# EAGLE design 2_main (EAGLE 7.2.0)
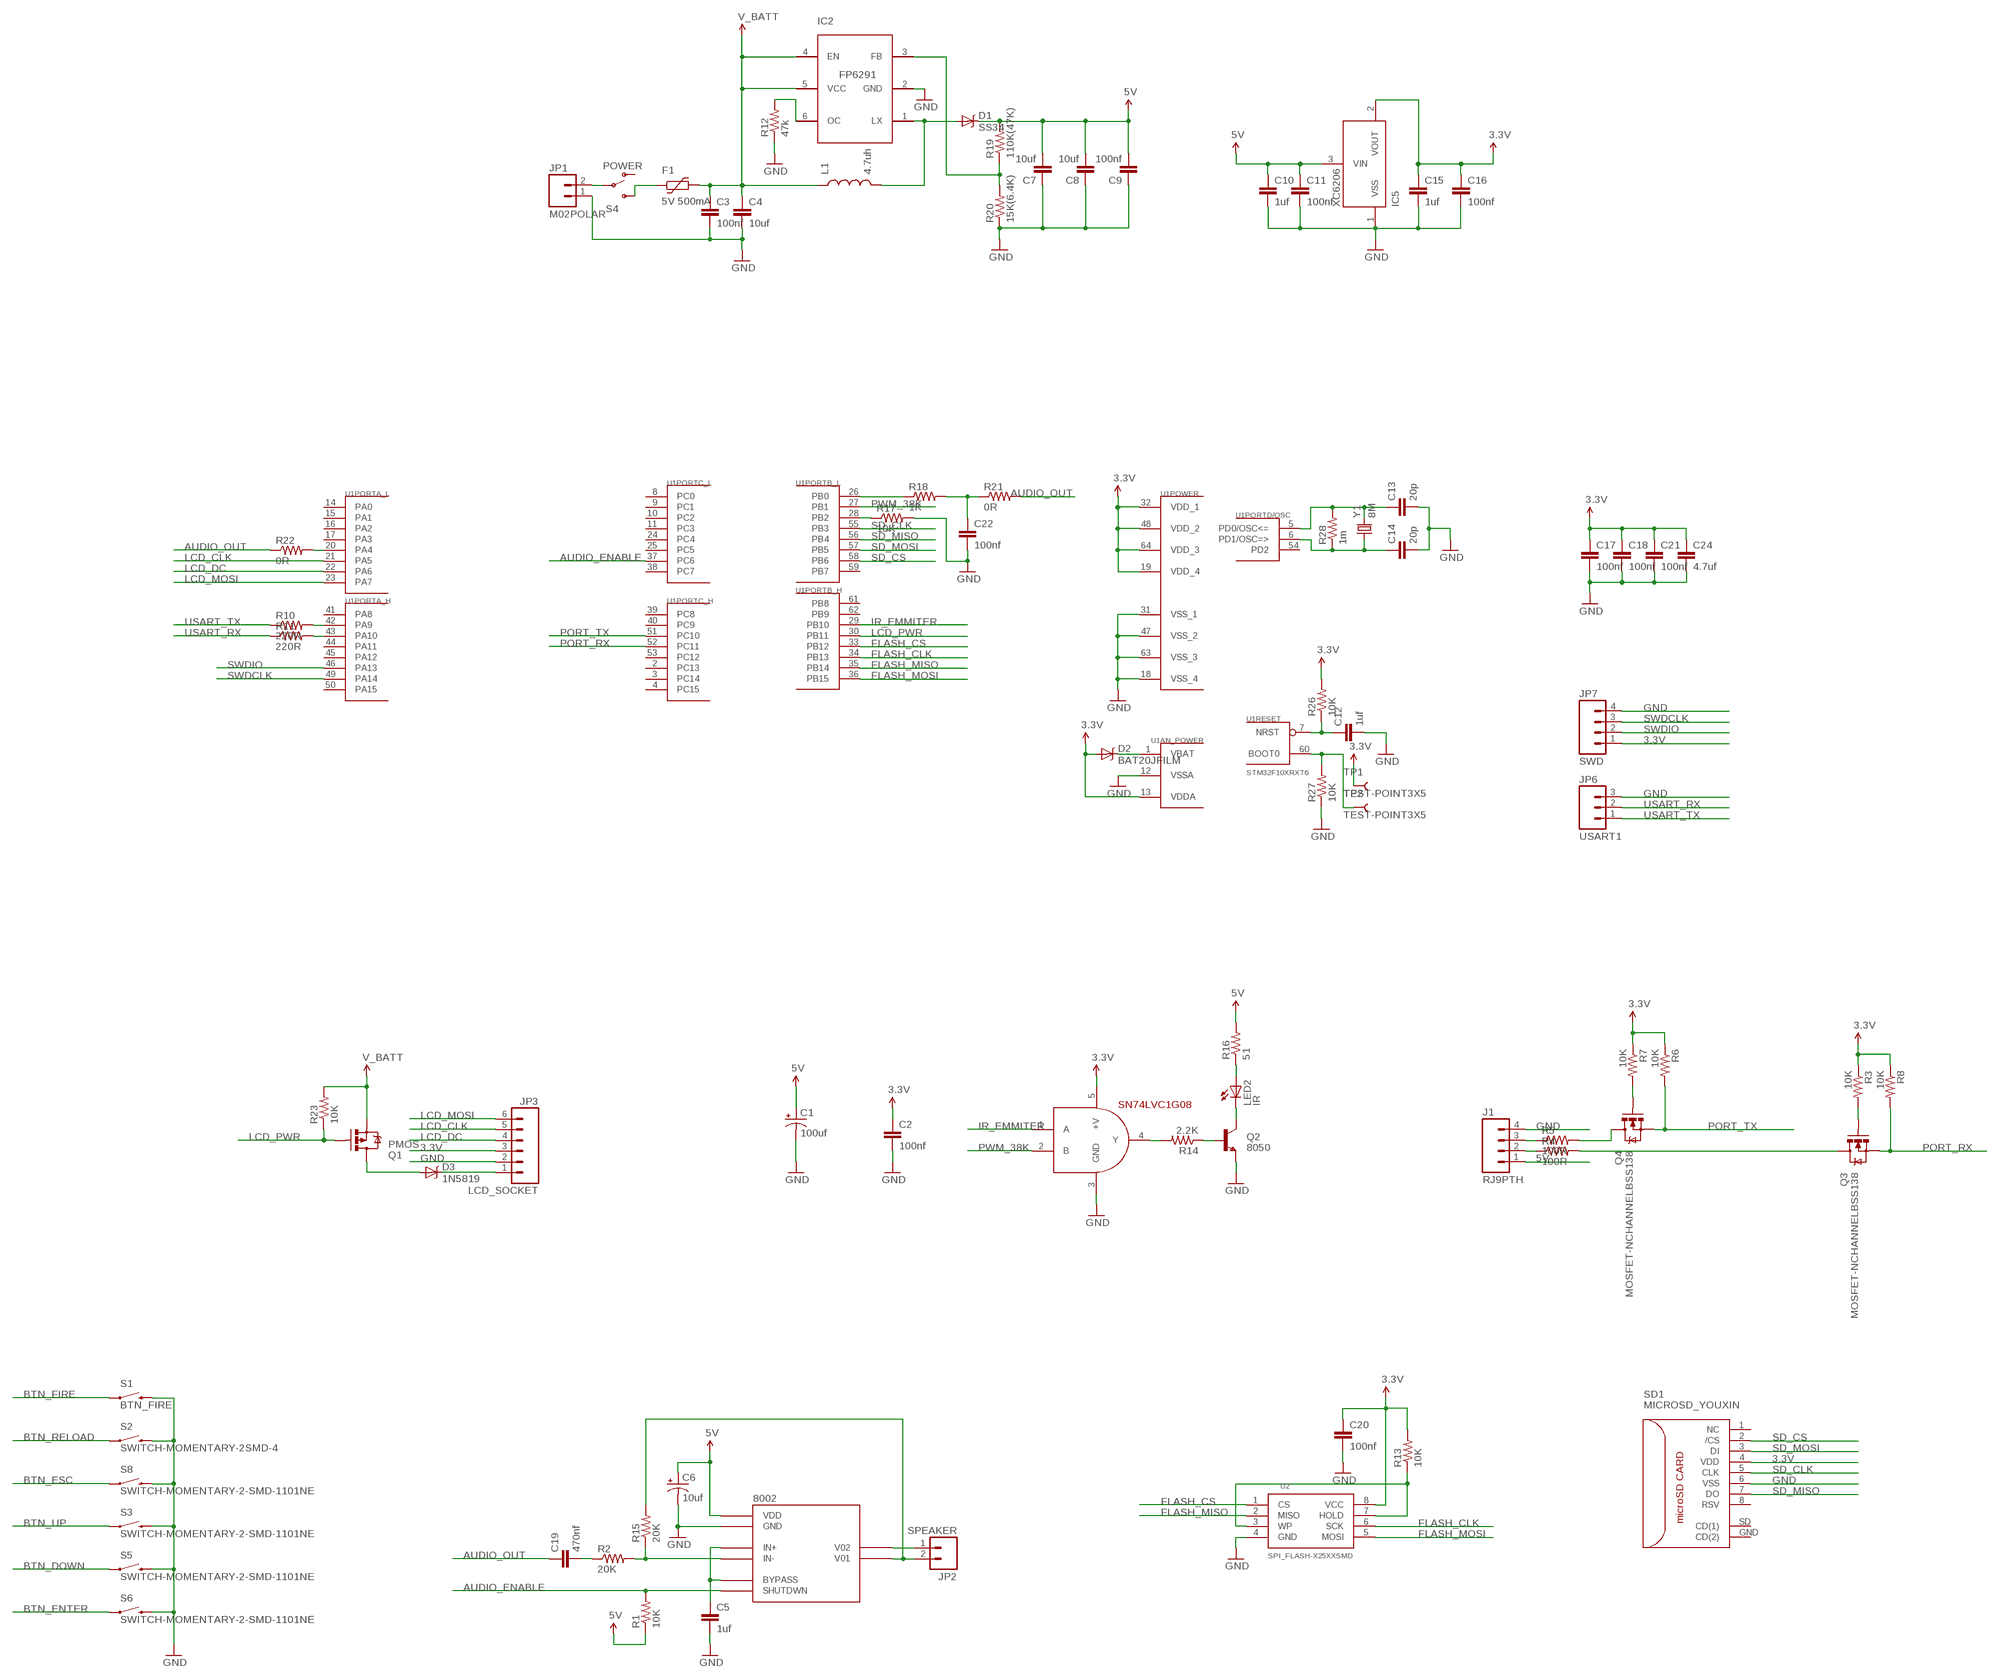
[diagram p0: schematic, sheet 1]

## Parts
8002  LM4871  [SO08]
C1  100uf  CAP_POL6032  [EIA6032]
C2  100nf  CAP0603-CAP  [0603-CAP]
C3  100nf  CAP0603-CAP  [0603-CAP]
C4  10uf  CAP0603-CAP  [0603-CAP]
C5  1uf  CAP0603-CAP  [0603-CAP]
C6  10uf  CAP_POL1206-KIT  [EIA3216-KIT]
C7  10uf  CAP0603-CAP  [0603-CAP]
C8  10uf  CAP0603-CAP  [0603-CAP]
C9  100nf  CAP0603-CAP  [0603-CAP]
C10  1uf  CAP0603-CAP  [0603-CAP]
C11  100nf  CAP0603-CAP  [0603-CAP]
C12  1uf  CAP0603-CAP  [0603-CAP]
C13  20p  CAP0603-CAP  [0603-CAP]
C14  20p  CAP0603-CAP  [0603-CAP]
C15  1uf  CAP0603-CAP  [0603-CAP]
C16  100nf  CAP0603-CAP  [0603-CAP]
C17  100nf  CAP0603-CAP  [0603-CAP]
C18  100nf  CAP0603-CAP  [0603-CAP]
C19  470nf  CAP0603-CAP  [0603-CAP]
C20  100nf  CAP0603-CAP  [0603-CAP]
C21  100nf  CAP0603-CAP  [0603-CAP]
C22  100nf  CAP0603-CAP  [0603-CAP]
C24  4.7uf  CAP0603-CAP  [0603-CAP]
D1  SS34  DIODE-SCHOTTKY_  [SMA-DIODE]
D2  BAT20JFILM  [SOD-323]
D3  1N5819  BAT20JFILM  [SOD-323]
F1  5V 500mA  PTC-FUSE  [R0805]
IC1  SN74LVC1G08  [SOT23-5]
IC2  FP6291  [SOT23-6]
IC5  XC6206  [SOT23-3]
J1  RJ9PTH  [RJ9]
JP1  M02POLAR  [MOLEX-1X2]
JP2  SPEAKER  M02POLAR  [MOLEX-1X2]
JP3  LCD_SOCKET  M06POLAR  [MOLEX-1X6]
JP6  USART1  M03PTH  [1X03]
JP7  SWD  M04PTH  [1X04]
L1  4.7uh  INDUCTORCR75_V2  [CR75_V2]
LED2  IR  LED5MM  [LED5MM]
Q1  PMOS  MOSFET-PCHANNELSMD  [SOT23-3]
Q2  8050  TRANSISTOR_NPNSOT23  [SOT23]
Q3  MOSFET-NCHANNELBSS138  [SOT23]
Q4  MOSFET-NCHANNELBSS138  [SOT23]
R1  10K  RESISTOR0603-RES  [0603-RES]
R2  20K  RESISTOR0603-RES  [0603-RES]
R3  10K  RESISTOR0603-RES  [0603-RES]
R4  100R  RESISTOR0603-RES  [0603-RES]
R5  100R  RESISTOR0603-RES  [0603-RES]
R6  10K  RESISTOR0603-RES  [0603-RES]
R7  10K  RESISTOR0603-RES  [0603-RES]
R8  10K  RESISTOR0603-RES  [0603-RES]
R10  220R  RESISTOR0603-RES  [0603-RES]
R11  220R  RESISTOR0603-RES  [0603-RES]
R12  47k  RESISTOR0603-RES  [0603-RES]
R13  10K  RESISTOR0603-RES  [0603-RES]
R14  2.2K  RESISTOR0603-RES  [0603-RES]
R15  20K  RESISTOR0603-RES  [0603-RES]
R16  51  RESISTOR0603-RES  [0603-RES]
R17  10K  RESISTOR0603-RES  [0603-RES]
R18  1K  RESISTOR0603-RES  [0603-RES]
R19  110K(47K)  RESISTOR0603-RES  [0603-RES]
R20  15K(6.4K)  RESISTOR0603-RES  [0603-RES]
R21  0R  RESISTOR0603-RES  [0603-RES]
R22  0R  RESISTOR0603-RES  [0603-RES]
R23  10K  RESISTOR0603-RES  [0603-RES]
R26  10K  RESISTOR0603-RES  [0603-RES]
R27  10K  RESISTOR0603-RES  [0603-RES]
R28  1m  RESISTOR0603-RES  [0603-RES]
S1  BTN_FIRE  SWITCH-MOMENTARY-2SMD-4  [TACTILE_SWITCH_TALL]
S2  SWITCH-MOMENTARY-2SMD-4  [TACTILE_SWITCH_TALL]
S3  SWITCH-MOMENTARY-2-SMD-1101NE  [TACTILE-SWITCH-1101NE]
S4  POWER  SWITCH-SPST3AM6  [SWITCH-SPDT-AM#6]
S5  SWITCH-MOMENTARY-2-SMD-1101NE  [TACTILE-SWITCH-1101NE]
S6  SWITCH-MOMENTARY-2-SMD-1101NE  [TACTILE-SWITCH-1101NE]
S8  SWITCH-MOMENTARY-2-SMD-1101NE  [TACTILE-SWITCH-1101NE]
SD1  MICROSD_YOUXIN  [MICRO_SD_YOUXIN]
TP1  TEST-POINT3X5  [PAD.03X.05]
TP2  TEST-POINT3X5  [PAD.03X.05]
U1  STM32F10XRXT6  [TQFP64]
U2  SPI_FLASH-X25XXSMD  [SO08]
Y1  8M  CRYSTALTXC-7A  [CRYSTAL-TXC-7A]

## Nets
3.3V: C2.1 C15.1 C16.1 C17.1 C18.1 C20.1 C21.1 C24.1 D2.2(A) IC1.5(+V) IC5.2(VOUT) JP3.3 JP7.1 R3.1 R6.1 R7.1 R8.1 R13.2 R26.2 SD1.4(VDD) TP1.P$1 U1.13(AN_POWER:VDDA) U1.19(POWER:VDD_4) U1.32(POWER:VDD_1) U1.48(POWER:VDD_2) U1.64(POWER:VDD_3) U2.8(VCC)
5V: 8002.6(VDD) C1.P$1(+) C6.A(+) C7.2 C8.2 C9.2 C10.1 C11.1 D1.C IC5.3(VIN) J1.1 R1.1 R16.2 R19.2
AUDIO_ENABLE: 8002.1(SHUTDWN) R1.2 U1.37(PORTC_L:PC6)
AUDIO_OUT: C19.1 R21.2 R22.1
BTN_DOWN: S5.P$1
BTN_ENTER: S6.P$1
BTN_ESC: S8.P$1
BTN_FIRE: S1.A2
BTN_RELOAD: S2.A2
BTN_UP: S3.P$1
FLASH_CLK: U1.34(PORTB_H:PB13) U2.6(SCK)
FLASH_CS: U1.33(PORTB_H:PB12) U2.1(CS)
FLASH_MISO: U1.35(PORTB_H:PB14) U2.2(MISO)
FLASH_MOSI: U1.36(PORTB_H:PB15) U2.5(MOSI)
GND: 8002.7(GND) C1.P$2(-) C2.2 C3.2 C4.2 C5.2 C6.C(-) C7.1 C8.1 C9.1 C10.2 C11.2 C12.2 C13.2 C14.2 C15.2 C16.2 C17.2 C18.2 C20.2 C21.2 C22.2 C24.2 IC1.3(GND) IC2.2(GND) IC5.1(VSS) J1.4 JP1.1 JP3.2 JP6.3 JP7.4 Q2.2(E) R12.1 R17.2 R20.1 R27.1 S1.B2 S2.B2 S3.P$2 S5.P$2 S6.P$2 S8.P$2 SD1.6(VSS) U1.12(AN_POWER:VSSA) U1.18(POWER:VSS_4) U1.31(POWER:VSS_1) U1.47(POWER:VSS_2) U1.63(POWER:VSS_3) U2.4(GND)
IR_EMMITER: IC1.1(A) U1.29(PORTB_H:PB10)
LCD_CLK: JP3.5 U1.21(PORTA_L:PA5)
LCD_DC: JP3.4 U1.22(PORTA_L:PA6)
LCD_MOSI: JP3.6 U1.23(PORTA_L:PA7)
LCD_PWR: Q1.1(G) R23.1 U1.30(PORTB_H:PB11)
N$1: R17.1 U1.28(PORTB_L:PB2)
N$2: R27.2 TP2.P$1 U1.60(RESET:BOOT0)
N$3: C13.1 R28.2 U1.5(PORTD/OSC:PD0/OSC<=) Y1.P$2
N$4: C14.1 R28.1 U1.6(PORTD/OSC:PD1/OSC=>) Y1.P$1
N$5: D2.1(C) U1.1(AN_POWER:VBAT)
N$6: IC1.4(Y) R14.2
N$7: JP1.2 S4.2(P)
N$8: LED2.K(C) Q2.3(C)
N$9: Q2.1(B) R14.1
N$10: F1.1 S4.3(S)
N$11: Q3.3(D) R4.2
N$12: J1.3 R5.1
N$13: Q4.3(D) R5.2
N$14: R18.1 U1.26(PORTB_L:PB0)
N$15: 8002.8(V02) JP2.1
N$16: Q4.1(G) R7.2
N$17: Q3.1(G) R3.2
N$18: 8002.5(V01) JP2.2 R15.2
N$19: C19.2 R2.1
N$20: LED2.A R16.1
N$21: 8002.4(IN-) R2.2 R15.1
N$22: D1.A IC2.1(LX) L1.P$2
N$23: IC2.6(OC) R12.2
N$24: 8002.2(BYPASS) 8002.3(IN+) C5.1
N$25: IC2.3(FB) R19.1 R20.2
N$26: R13.1 U2.3(WP) U2.7(HOLD)
N$27: R10.2 U1.42(PORTA_H:PA9)
N$28: R11.2 U1.43(PORTA_H:PA10)
N$29: D3.1(C) JP3.1
N$30: C22.1 R18.2 R21.1
N$31: R22.2 U1.20(PORTA_L:PA4)
N$32: D3.2(A) Q1.3(D)
N$40: J1.2 R4.1
N$44: C12.1 R26.1 U1.7(RESET:NRST)
PORT_RX: Q3.2(S) R8.2 U1.52(PORTC_H:PC11)
PORT_TX: Q4.2(S) R6.2 U1.51(PORTC_H:PC10)
PWM_38K: IC1.2(B) U1.27(PORTB_L:PB1)
SD_CLK: SD1.5(CLK) U1.55(PORTB_L:PB3)
SD_CS: SD1.2(/CS) U1.58(PORTB_L:PB6)
SD_MISO: SD1.7(DO) U1.56(PORTB_L:PB4)
SD_MOSI: SD1.3(DI) U1.57(PORTB_L:PB5)
SWDCLK: JP7.3 U1.49(PORTA_H:PA14)
SWDIO: JP7.2 U1.46(PORTA_H:PA13)
USART_RX: JP6.2 R11.1
USART_TX: JP6.1 R10.1
V_BATT: C3.1 C4.1 F1.2 IC2.4(EN) IC2.5(VCC) L1.P$1 Q1.2(S) R23.2
Unconnected: S4.1(O) SD1.1(NC) SD1.8(RSV) SD1.GND(CD(2)) SD1.SD(CD(1)) U1.2(PORTC_H:PC13) U1.3(PORTC_H:PC14) U1.4(PORTC_H:PC15) U1.8(PORTC_L:PC0) U1.9(PORTC_L:PC1) U1.10(PORTC_L:PC2) U1.11(PORTC_L:PC3) U1.14(PORTA_L:PA0) U1.15(PORTA_L:PA1) U1.16(PORTA_L:PA2) U1.17(PORTA_L:PA3) U1.24(PORTC_L:PC4) U1.25(PORTC_L:PC5) U1.38(PORTC_L:PC7) U1.39(PORTC_H:PC8) U1.40(PORTC_H:PC9) U1.41(PORTA_H:PA8) U1.44(PORTA_H:PA11) U1.45(PORTA_H:PA12) U1.50(PORTA_H:PA15) U1.53(PORTC_H:PC12) U1.54(PORTD/OSC:PD2) U1.59(PORTB_L:PB7) U1.61(PORTB_H:PB8) U1.62(PORTB_H:PB9)

## Library data of the parts
8002 = SparkFun-PowerIC:LM4871: 3W audio amplifier
C1 C6 = SparkFun-Capacitors:CAP_POL: Capacitor Polarized These are standard SMD and PTH capacitors. Normally 10uF, 47uF, and 100uF in electrolytic and tantalum varieties. Always verify the external diameter of the through hole cap, it varies with capacity, voltage, and manufacturer. The EIA devices should be standard.
C2-C5 C7-C22 C24 = SparkFun-Passives:CAP: Capacitor Standard 0603 ceramic capacitor, and 0.1" leaded capacitor.
D1 = SparkFun-DiscreteSemi:DIODE-SCHOTTKY: Commonly MBRA140.
D2 = SparkFun-DiscreteSemi:BAT20JFILM: 23V, 1A Schottky diode, SOD-323 package; PROD_ID: DIO-11623
D3 = SparkFun-DiscreteSemi:BAT20JFILM: 23V, 1A Schottky diode, SOD-323 package; PROD_ID: DIO-11623; VALUE: BAT20JFILM
F1 = digital-toy:PTC-FUSE
IC1 = SparkFun-DigitalIC:SN74LVC1G08: Single-gate AND logic
IC2 = eagle_lib_lishen:FP6291
IC5 = SparkFun-PowerIC:XC6206: Low ESR Cap. Compatible Positive Voltage Regulator
J1 = SparkFun-Connectors:RJ9: RJ9 connector (e.g., phone handsets)
JP1 JP2 = SparkFun-Connectors:M02: Standard 2-pin 0.1" header. Use with - straight break away headers ( PRT-00116) - right angle break away headers (PRT-00553) - swiss pins (PRT-00743) - machine pins (PRT-00117) - female headers (PRT-00115) Molex polarized connector foot print use with: PRT-08233 with associated crimp pins and housings. 2.54_SCREWTERM for use with PRT-10571. 3.5mm Screw Terminal footprints for PRT-08084 5mm Screw Terminal footprints for use with PRT-08433
JP3 = SparkFun-Connectors:M06: Header 6 Standard 6-pin 0.1" header. Use with straight break away headers (SKU : PRT-00116), right angle break away headers (PRT-00553), swiss pins (PRT-00743), machine pins (PRT-00117), and female headers (PRT-00115). Molex polarized connector foot print use with SKU : PRT-08094 with associated crimp pins and housings. NOTES ON THE VARIANTS LOCK and LOCK_LONGPADS... This footprint was designed to help hold the alignment of a through-hole component (i.e. 6-pin header) while soldering it into place. You may notice that each hole has been shifted either up or down by 0.005 of an inch from it's more standard position (which is a perfectly straight line). This slight alteration caused the pins (the squares in the middle) to touch the edges of the holes. Because they are alternating, it causes a "brace" to hold the component in place. 0.005 has proven to be the perfect amount of "off-center" position when using our standard breakaway headers. Although looks a little odd when you look at the bare footprint, once you have a header in there, the alteration is very hard to notice. Also,if you push a header all the way into place, it is covered up entirely on the bottom side. This idea of altering the position of holes to aid alignment will be further integrated into the Sparkfun Library for other footprints. It can help hold any component with 3 or more connection pins.
JP6 = SparkFun-Connectors:M03: Header 3 Standard 3-pin 0.1" header. Use with straight break away headers (SKU : PRT-00116), right angle break away headers (PRT-00553), swiss pins (PRT-00743), machine pins (PRT-00117), and female headers (PRT-00115). Molex polarized connector foot print use with SKU : PRT-08232 with associated crimp pins and housings.
JP7 = SparkFun-Connectors:M04: Header 4 Standard 4-pin 0.1" header. Use with straight break away headers (SKU : PRT-00116), right angle break away headers (PRT-00553), swiss pins (PRT-00743), machine pins (PRT-00117), and female headers (PRT-00115). Molex polarized connector foot print use with SKU : PRT-08231 with associated crimp pins and housings. 1MM SMD Version SKU: PRT-10208
L1 = SparkFun-Passives:INDUCTOR: Inductors Basic Inductor/Choke - 0603 and 1206. Footprints are not proven and vary greatly between part numbers. SRN6045- 33uH, 20% 1.4A SDR0403-560KL - 56uH, 10%, 500mA RMS/740mA peak
LED2 = SparkFun-LED:LED: LEDs Standard schematic elements and footprints for 5mm, 3mm, 1206, and 0603 sized LEDs. 5mm - Spark Fun Electronics SKU : COM-00529 (and others)
Q1 = SparkFun-DiscreteSemi:MOSFET-PCHANNEL: Generic PMOSFET
Q2 = SparkFun-DiscreteSemi:TRANSISTOR_NPN: Generic NPN BJT MMBT2222A - TRANS-08049 (SOT-23, 1A 40V) MPSA42 - TRANS-09116 (SOT-23, 500mA 300V) MMBT5088LT1G - TRANS-11160 (SOT-23, 50 mA 30V)
Q3 Q4 = SparkFun-DiscreteSemi:MOSFET-NCHANNEL: Common NMOSFET Parts MFG P/N Store ID Prod ID FDD8780 TRANS-09984 SI7820DN TRANS-11055 FDS6630A IC-08089 2N7002PW TRANS-11151 FQP30N06L COM-10213 TRANS-10060 BSS123LT1G TRANS-08345 BSS138 TRANS-00830 BS170 2N7000; PROD_ID: TRANS-00830
R1-R8 R10-R23 R26-R28 = SparkFun-Passives:RESISTOR: Resistor Basic schematic elements and footprints for 0603, 1206, and PTH resistors.
S1-S3 S5 S6 S8 = SparkFun-Electromechanical:SWITCH-MOMENTARY-2: Various NO switches- pushbuttons, reed, etc
S4 = digital-toy:SWITCH-SPST: SPST Switch Simple slide switch. Spark Fun Electronics SKU : COM-00102
SD1 = eagle_lib_lishen:MICROSD_YOUXIN
TP1 TP2 = SparkFun-Passives:TEST-POINT: Bare copper test points for troubleshooting or ICT
U1 = stm32:STM32F10XRXT6: STM32F101/103 64pin LQFP
U2 = SparkFun-DigitalIC:SPI_FLASH-X25XX: 8pin SPI Flash series x25xx. Works with devices like W25X32 and BR25L32
Y1 = SparkFun-FreqCtrl:CRYSTAL: Various standard crystals. Proven footprints. Spark Fun Electronics SKU : COM-00534

## Board
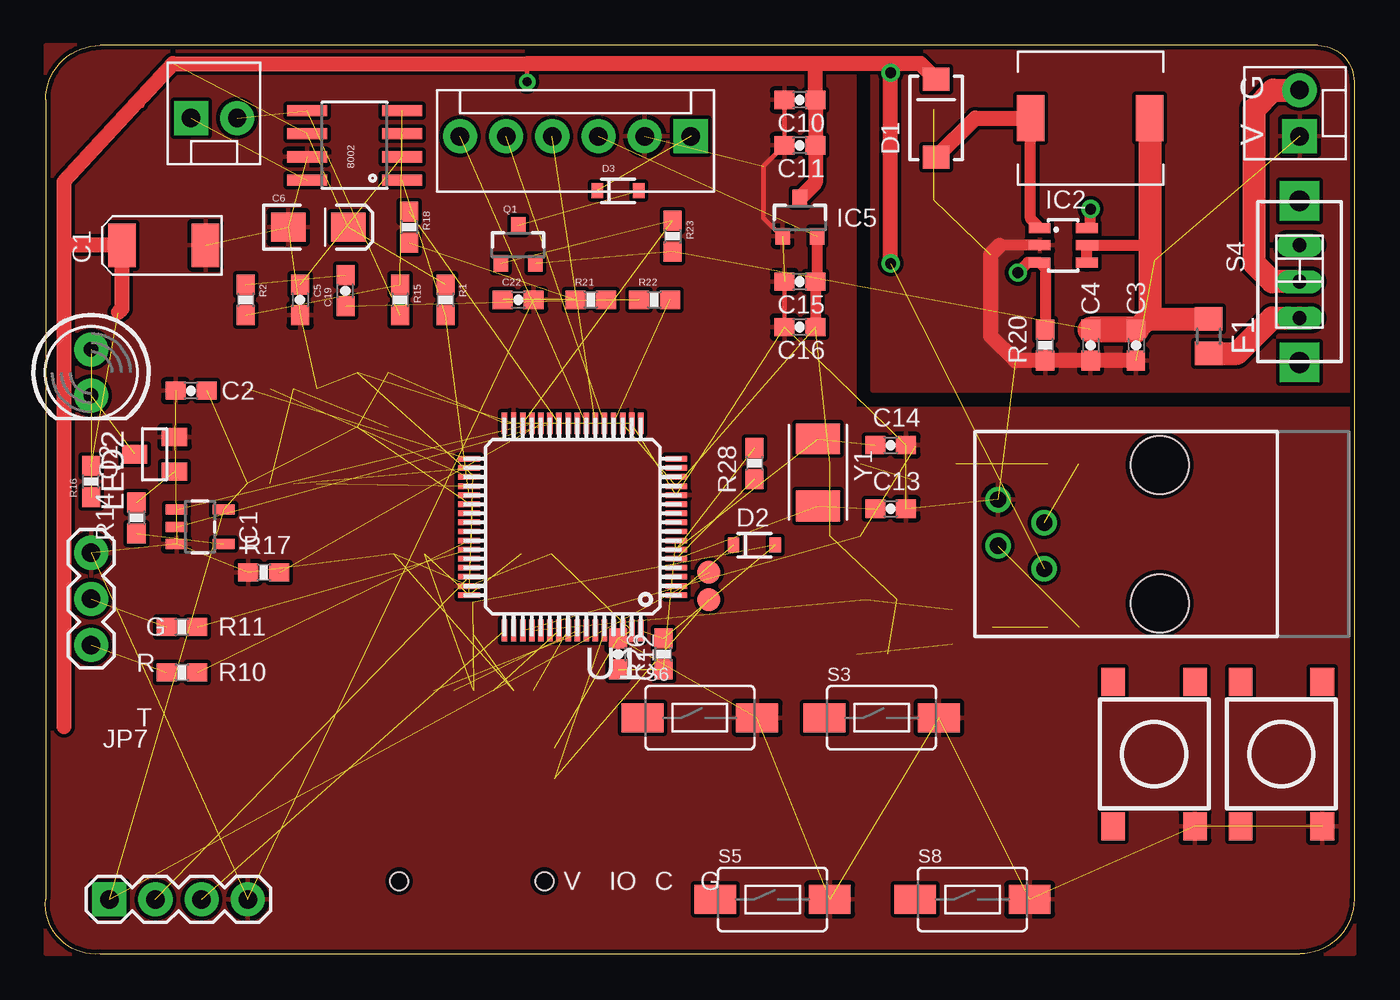
[diagram p1: board, top side]
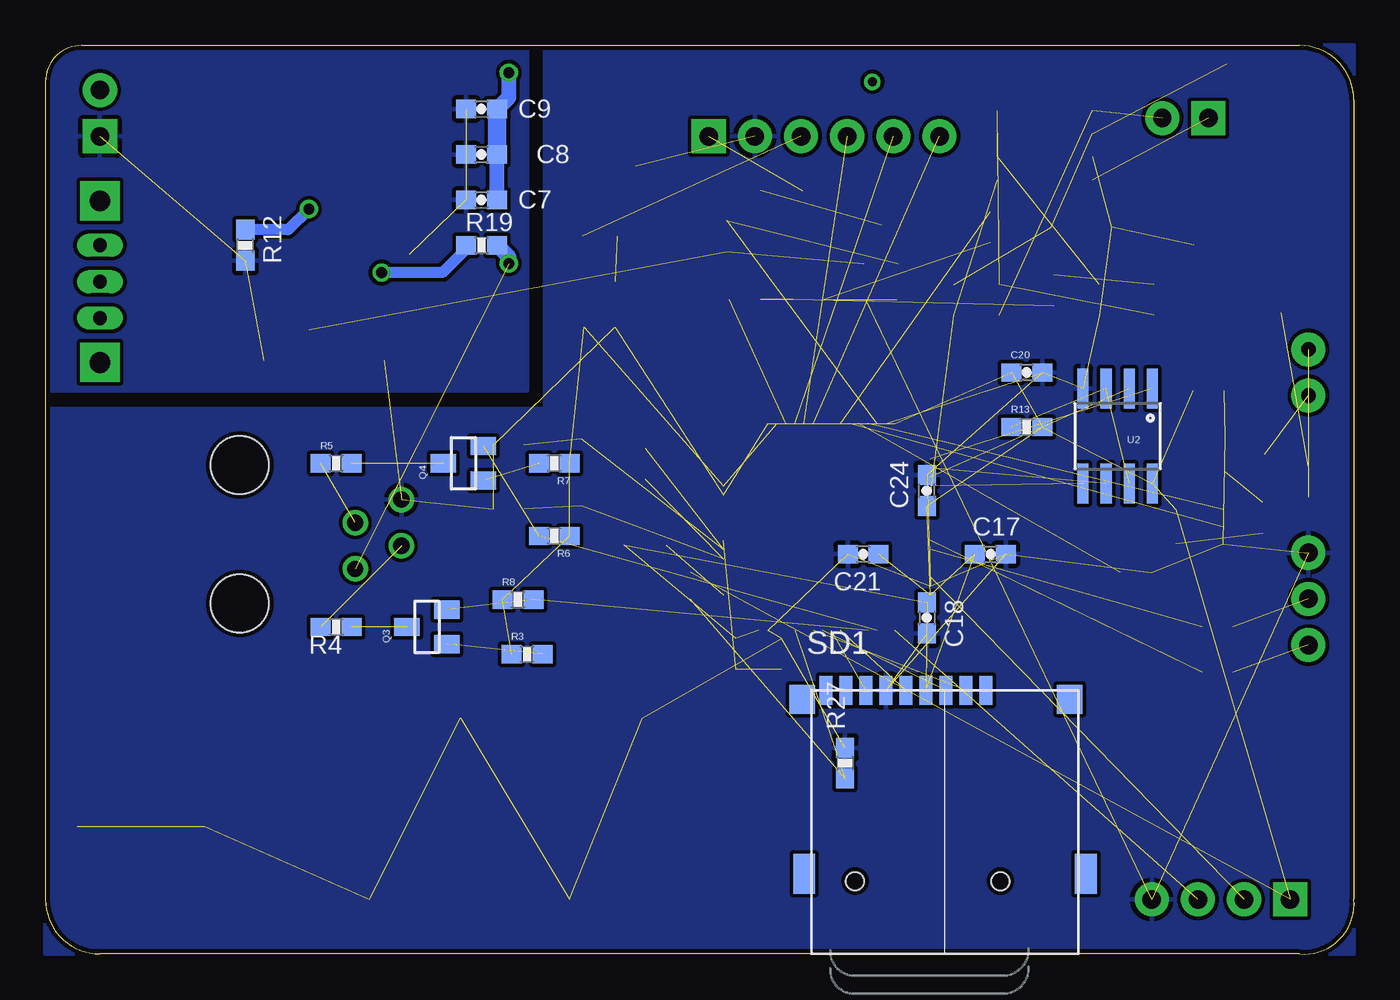
[diagram p2: board, bottom side, seen from below]

Size 72.01 x 50.01 mm. Coordinates in mm from the lower left corner, seen from the top.
Outline: 70.01,50.01 3.01,50.01 arc90 0.01,47.01 0.01,3.01 arc100 3.01,0.01 69.01,0.01 arc90 72.01,3.01 72.01,48.01 arc90 70.01,50.01
Copper layers (1*16): Top 0.035mm / dielectric 1.5mm / Bottom 0.035mm
Design rules "default *": minimum track width 10mil, minimum drill 0.5mm, track to track 8mil, track to pad 8mil, pad to pad 8mil, via to via 8mil, smd to smd 8mil, copper to edge 10mil, drill to drill 8mil, minimum pad ring 10mil, minimum via ring 8mil, stop-mask expansion 4mil, vias tented up to drill 0mil, thermal gap 10mil

### Footprints (pad centres in the part's own frame; a part is rotated, then mirrored left to right if it is on the bottom)
SO08 = smd 0.61 x 2.21: 1 -1.905,-2.616; 2 -0.635,-2.616; 3 0.635,-2.616; 4 1.905,-2.616; 5 1.905,2.616; 6 0.635,2.616; 7 -0.635,2.616; 8 -1.905,2.616
EIA6032 = smd 1.5 x 2.4: P$1 -2.3,0; P$2 2.3,0
0603-CAP = smd 1.1 x 1: 1 -0.85,0; 2 0.85,0
EIA3216-KIT = smd 1.9 x 1.6: A 1.65,0; C -1.65,0
SMA-DIODE = smd 1.27 x 1.47: A -2.15,0; C 2.15,0
SOD-323 = smd 0.63 x 0.83: 1 -1.15,0; 2 1.15,0
R0805 = smd 1.3 x 1.5: 1 -0.95,0; 2 0.95,0
SOT23-5 = smd 0.55 x 1.2: 1 -0.95,-1.3; 2 0,-1.3; 3 0.95,-1.3; 4 0.95,1.3; 5 -0.95,1.3
SOT23-6 = smd 0.55 x 1.2: 1 -0.95,-1.3; 2 0,-1.3; 3 0.95,-1.3; 4 0.95,1.3; 5 0,1.3; 6 -0.95,1.3
SOT23-3 = smd 0.8 x 0.9: 1 -0.95,-1; 2 0.95,-1; 3 0,1.1
RJ9 = drill 0.889: 1 -1.905,6.35; 2 -0.635,8.89; 3 0.635,6.35; 4 1.905,8.89 | hole 3.2: -3.81,0; 3.81,0
MOLEX-1X2 = drill 1.016 pad 1.88 square: 1 0,0 | drill 1.016 pad 1.88: 2 2.54,0
MOLEX-1X6 = drill 1.016 pad 1.88 square: 1 0,0 | drill 1.016 pad 1.88: 2 2.54,0; 3 5.08,0; 4 7.62,0; 5 10.16,0; 6 12.7,0
1X03 = drill 1.016 pad 1.88: 1 0,0; 2 2.54,0; 3 5.08,0
1X04 = drill 1.016 pad 1.88 square: 1 0,0 | drill 1.016 pad 1.88: 2 2.54,0; 3 5.08,0; 4 7.62,0
CR75_V2 = smd 1.524 x 2.54: P$1 -0.254,0; P$2 6.304,0
LED5MM = drill 0.813 pad 1.88: A -1.27,0; K 1.27,0
SOT23 = smd 1 x 1.4: 1 -0.95,-1.1; 2 0.95,-1.1; 3 0,1.1
0603-RES = smd 1.1 x 1: 1 -0.85,0; 2 0.85,0
TACTILE_SWITCH_TALL = smd 1.55 x 1.3: A1 -3.975,-2.25; A2 3.975,-2.25; B1 -3.975,2.25; B2 3.975,2.25
TACTILE-SWITCH-1101NE = smd 2.3 x 1.6: P$1 -3.15,0; P$2 3.15,0
SWITCH-SPDT-AM#6 = drill 0.762 pad 1.27 long: 1 0,2; 2 0,0; 3 0,-2 | drill 1.15 pad 2.184 square: P$1 0,-4.445; P$2 0,4.445
MICRO_SD_YOUXIN = smd 0.7 x 1.6: 1 2.25,14.5; 2 1.15,14.5; 3 0.05,14.5; 4 -1.05,14.5; 5 -2.15,14.5; 6 -3.25,14.5; 7 -4.35,14.5; 8 -5.45,14.5; SD -6.55,14.5 | smd 1.4 x 1.6: GND -7.85,14; P$4 6.85,14 | smd 1.2 x 2.2: P$1 -7.75,4.4; P$3 7.75,4.4 | hole 1: 3.05,4; -4.95,4
PAD.03X.05 = smd 1.27 x 1.27: P$1 0,0
TQFP64 = smd 1.2 x 0.3: 1 -5.7,3.75; 2 -5.7,3.25; 3 -5.7,2.75; 4 -5.7,2.25; 5 -5.7,1.75; 6 -5.7,1.25; 7 -5.7,0.75; 8 -5.7,0.25; 9 -5.7,-0.25; 10 -5.7,-0.75; 11 -5.7,-1.25; 12 -5.7,-1.75; 13 -5.7,-2.25; 14 -5.7,-2.75; 15 -5.7,-3.25; 16 -5.7,-3.75; 33 5.7,-3.75; 34 5.7,-3.25; 35 5.7,-2.75; 36 5.7,-2.25; 37 5.7,-1.75; 38 5.7,-1.25; 39 5.7,-0.75; 40 5.7,-0.25; 41 5.7,0.25; 42 5.7,0.75; 43 5.7,1.25; 44 5.7,1.75; 45 5.7,2.25; 46 5.7,2.75; 47 5.7,3.25; 48 5.7,3.75 | smd 0.3 x 1.2: 17 -3.75,-5.7; 18 -3.25,-5.7; 19 -2.75,-5.7; 20 -2.25,-5.7; 21 -1.75,-5.7; 22 -1.25,-5.7; 23 -0.75,-5.7; 24 -0.25,-5.7; 25 0.25,-5.7; 26 0.75,-5.7; 27 1.25,-5.7; 28 1.75,-5.7; 29 2.25,-5.7; 30 2.75,-5.7; 31 3.25,-5.7; 32 3.75,-5.7; 49 3.75,5.7; 50 3.25,5.7; 51 2.75,5.7; 52 2.25,5.7; 53 1.75,5.7; 54 1.25,5.7; 55 0.75,5.7; 56 0.25,5.7; 57 -0.25,5.7; 58 -0.75,5.7; 59 -1.25,5.7; 60 -1.75,5.7; 61 -2.25,5.7; 62 -2.75,5.7; 63 -3.25,5.7; 64 -3.75,5.7
CRYSTAL-TXC-7A = smd 1.7 x 2.4: P$1 1.85,0; P$2 -1.85,0

### Placement (x,y rotation side)
8002  17.01,44.51 90 top
C1  6.51,39.01 0 top
C2  8.01,31.01 180 top
C3  60.01,33.51 270 top
C4  57.51,33.51 270 top
C5  14.01,36.01 270 top
C6  15.01,40.01 0 top
C7  48.01,41.51 0 bottom
C8  48.01,44.01 0 bottom
C9  48.01,46.51 0 bottom
C10  41.51,47.01 180 top
C11  41.51,44.51 180 top
C12  31.51,16.51 90 top
C13  46.51,24.51 0 top
C14  46.51,28.01 0 top
C15  41.51,37.01 180 top
C16  41.51,34.51 180 top
C17  20.01,22.01 0 bottom
C18  23.51,18.51 270 bottom
C19  16.51,36.51 90 top
C20  18.01,32.01 0 bottom
C21  27.01,22.01 180 bottom
C22  26.01,36.01 0 top
C24  23.51,25.51 90 bottom
D1  49.01,46.01 90 top
D2  39.01,22.51 0 top
D3  31.51,42.01 0 top
F1  64.01,34.01 90 top
IC1  8.51,23.51 270 top
IC2  56.01,39.01 270 top
IC5  41.51,40.51 0 top
J1  61.31,23.11 90 top
JP1  69.01,45.01 90 top
JP2  8.01,46.01 0 top
JP3  35.51,45.01 180 top
JP6  2.51,17.01 90 top
JP7  3.51,3.01 0 top
L1  60.51,46.01 180 top
LED2  2.51,32.01 270 top
Q1  26.01,39.01 0 top
Q2  6.01,27.51 90 top
Q3  51.01,18.01 90 bottom
Q4  49.01,27.01 90 bottom
R1  22.01,36.01 270 top
R2  11.01,36.01 270 top
R3  45.51,16.51 0 bottom
R4  56.01,18.01 0 bottom
R5  56.01,27.01 0 bottom
R6  44.01,23.01 180 bottom
R7  44.01,27.01 180 bottom
R8  46.01,19.51 0 bottom
R10  7.51,15.51 0 top
R11  7.51,18.01 0 top
R12  61.01,39.01 90 bottom
R13  18.01,29.01 0 bottom
R14  5.01,24.01 270 top
R15  19.51,36.01 270 top
R16  2.51,26.01 90 top
R17  12.01,21.01 180 top
R18  20.01,40.01 270 top
R19  48.01,39.01 0 bottom
R20  55.01,33.51 90 top
R21  30.01,36.01 0 top
R22  33.51,36.01 0 top
R23  34.51,39.51 270 top
R26  34.01,16.51 90 top
R27  28.01,10.51 270 bottom
R28  39.01,27.01 270 top
S1  61.01,11.01 270 top
S2  68.01,11.01 270 top
S3  46.01,13.01 0 top
S4  69.01,37.01 0 top
S5  40.01,3.01 0 top
S6  36.01,13.01 0 top
S8  51.01,3.01 0 top
SD1  22.51,0.01 0 bottom
TP1  36.51,21.01 0 top
TP2  36.51,19.51 0 top
U1  29.01,23.51 180 top
U2  13.01,28.51 180 bottom
Y1  42.51,26.51 90 top

### Tracks (layer width: path | path; a pad name or v marks a point on that pad's centre or on a via)
3.3V  (24 unrouted)
  Top 0.61: IC5.2 42.46,37.11 C15.1 C16.1
5V  (via drill 0.5, 0.6)  (5 unrouted)
  Top 0.254: v26.51,48.01 26.51,49.01 | 5.32,46.7 5.32,47.18 | 1.01,12.46 1.01,12.51
  Top 0.813: 1.01,39.01 1.01,42.51 5.32,47.18 7.01,49.01 26.51,49.01 42.51,49.01 | 1.01,39.01 1.01,12.51 | 4.01,35.31 4.21,35.51 C1.P$1 1.01,39.01 | IC5.3 42.36,42.46 C11.1 C10.1 42.36,48.86 42.51,49.01 | 46.51,49.01 48.16,49.01 D1.C | 46.51,49.01 42.51,49.01 | 46.51,49.01 v46.51,48.51 v46.51,38.01
  Bottom 0.61: C9.2 47.01,46.66
  Bottom 0.813: C7.2 C8.2 | C9.2 46.51,47.16 v46.51,48.51 | R19.2 46.51,38.36 v46.51,38.01
  Bottom 1.016: C9.2 C8.2
AUDIO_ENABLE  (2 unrouted)
AUDIO_OUT  (2 unrouted)
FLASH_CLK  (1 unrouted)
FLASH_CS  (1 unrouted)
FLASH_MISO  (1 unrouted)
FLASH_MOSI  (1 unrouted)
GND  (42 unrouted)
  Top 0.254: C10.2 C11.2 39.51,43.36 39.51,40.51 40.51,39.51 IC5.1 | C15.2 C16.2
  Top 0.61: IC2.2 52.51,39.01
  Top 0.813: C3.2 C4.2 R20.1 53.36,32.66 52.01,34.01 52.01,38.51 52.51,39.01
  pour Top: 45.51,50.01 45.51,31.01 72.01,31.01 72.01,50.01
  pour Bottom: 72.01,50.01 72.01,31.01 45.51,31.01 45.51,50.01
  pour Bottom: 0.01,50.01 44.51,50.01 44.51,30.01 72.01,30.01 72.01,0.01 0.01,0.01
  pour Top: 0.01,50.01 0.01,0.01 72.01,0.01 72.01,30.01 44.51,30.01 44.51,50.01
IR_EMMITER  (1 unrouted)
LCD_CLK  (1 unrouted)
LCD_DC  (1 unrouted)
LCD_MOSI  (1 unrouted)
LCD_PWR  (2 unrouted)
N$1  (1 unrouted)
N$2  (2 unrouted)
N$3  (3 unrouted)
N$4  (3 unrouted)
N$5  (1 unrouted)
N$6  (1 unrouted)
N$7
  Top 1.27: S4.2 67.51,37.01 66.51,38.01 66.51,46.51 67.55,47.55 JP1.2
N$8  (1 unrouted)
N$9  (1 unrouted)
N$10
  Top 1.27: F1.1 65.56,33.06 67.51,35.01 S4.3
N$11  (1 unrouted)
N$12  (1 unrouted)
N$13  (1 unrouted)
N$14  (1 unrouted)
N$15  (1 unrouted)
N$16  (1 unrouted)
N$17  (1 unrouted)
N$18  (2 unrouted)
N$19  (1 unrouted)
N$20  (1 unrouted)
N$21  (2 unrouted)
N$22
  Top 0.61: IC2.1 54.21,40.47 L1.P$2
  Top 0.813: D1.A 51.16,46.01 L1.P$2
N$23  (via drill 0.6)
  Top 0.61: IC2.6 57.51,40.16 v57.51,41.01
  Bottom 0.61: v57.51,41.01 58.66,39.86 R12.2
N$24  (2 unrouted)
N$25  (via drill 0.6)
  Top 0.61: R20.2 55.01,37.76 IC2.3 54.06,38.06 v53.51,37.51
  Bottom 0.61: v53.51,37.51 50.16,37.51 48.86,38.81 R19.1
N$26  (2 unrouted)
N$27  (1 unrouted)
N$28  (1 unrouted)
N$29  (1 unrouted)
N$30  (2 unrouted)
N$31  (1 unrouted)
N$32  (1 unrouted)
N$40  (1 unrouted)
N$44  (2 unrouted)
PORT_RX  (2 unrouted)
PORT_TX  (2 unrouted)
PWM_38K  (1 unrouted)
SD_CLK  (1 unrouted)
SD_CS  (1 unrouted)
SD_MISO  (1 unrouted)
SD_MOSI  (1 unrouted)
SWDCLK  (1 unrouted)
SWDIO  (1 unrouted)
USART_RX  (1 unrouted)
USART_TX  (1 unrouted)
V_BATT  (2 unrouted)
  Top 0.61: 60.77,39.01 IC2.5 IC2.4
  Top 1.27: L1.P$1 60.77,39.01 60.77,35.12 arc-90 60.61,34.96 | C3.1 60.61,34.96 | 60.61,34.96 F1.2
  Top 1.422: C3.1 C4.1

### Text on the board
tNames: G | V | C1 | G | R | T | V | IO | C | G